# EAGLE design mjpanel_v2 (EAGLE 6.5.0)
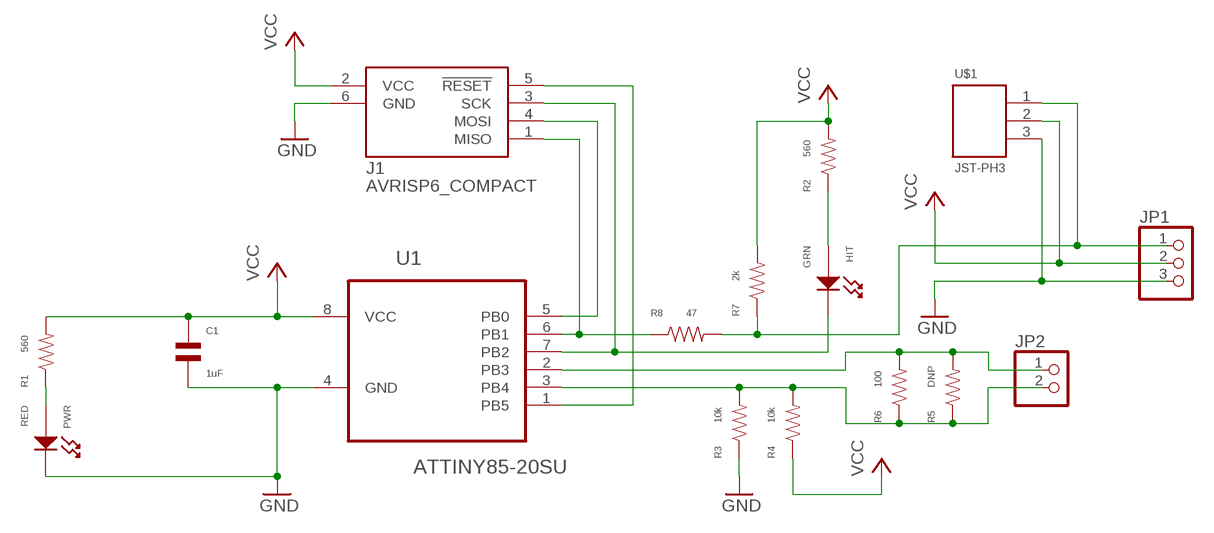
[diagram p0: schematic, sheet 1]

## Parts
C1  1uF  CAPACITOR_NP_0603  [C0603]
HIT  GRN  LED_SINGLE_0603  [LED0603]
J1  AVRISP6_COMPACT  [CON6P2R]
JP1  PINHD-1X3  [1X03]
JP2  PINHD-1X2  [1X02]
PWR  RED  LED_SINGLE_0603  [LED0603]
R1  560  RESISTOR_0603  [R0603]
R2  560  RESISTOR_0603  [R0603]
R3  10k  RESISTOR_0603  [R0603]
R4  10k  RESISTOR_0603  [R0603]
R5  DNP  RESISTOR_0603  [R0603]
R6  100  RESISTOR_0603  [R0603]
R7  2k  RESISTOR_0603  [R0603]
R8  47  RESISTOR_0603  [R0603]
U1  ATTINY85-20SU  [SOIC127P798X216-8N]
U$1  JST-PH3  [JST-PH3]

## Nets
GND: C1.P$2 J1.6(GND) JP1.3 PWR.CATHODE R3.P$1 U1.4(GND) U$1.3
N$1: PWR.ANODE R1.P$1
N$2: J1.5(!RESET) U1.1(PB5)
N$3: JP2.2 R3.P$2 R4.P$2 R5.P$1 R6.P$1 U1.3(PB4)
N$4: HIT.CATHODE J1.3(SCK) U1.7(PB2)
N$5: HIT.ANODE R2.P$1
N$6: JP2.1 R5.P$2 R6.P$2 U1.2(PB3)
N$7: J1.4(MOSI) U1.5(PB0)
N$8: JP1.1 R7.P$1 R8.P$2 U$1.1
N$9: J1.1(MISO) R8.P$1 U1.6(PB1)
VCC: C1.P$1 J1.2(VCC) JP1.2 R1.P$2 R2.P$2 R4.P$1 R7.P$2 U1.8(VCC) U$1.2

## Library data of the parts
C1 = MF_Passives:CAPACITOR_NP: Library: MF_Passives Description: Device for Non-Polarized Capacitors. Manufacture part number (MFG#), Voltage, Temperature Coefficient, and Tolerance can be added via Attributes.; DPN: 490-3897-1-ND; MFG#: N/A; PRICE10: 0.0440; TEMP_COF: N/A; TOLERANCE: N/A; VOLTAGE: N/A
HIT = MF_LEDs:LED_SINGLE: Library: MF_LEDs Description: Device for Single LED Packages. Manufacture part number (MFG#) can be added via Attributes.; DPN: 160-1446-1-ND; MFG#: N/A; PRICE10: 0.238
J1 = target:AVRISP6: 6-pin dual-row connector for Atmel AVRISP programmer interface; DPN: OR1108-ND; PRICE10: 0.399
JP1 = pinhead:PINHD-1X3: PIN HEADER; DPN: 952-2245-ND; PRICE10: 0.155
JP2 = pinhead:PINHD-1X2: PIN HEADER; DPN: 490-7800-ND; PRICE10: 0.794
PWR = MF_LEDs:LED_SINGLE: Library: MF_LEDs Description: Device for Single LED Packages. Manufacture part number (MFG#) can be added via Attributes.; DPN: 160-1436-1-ND; MFG#: N/A; PRICE10: 0.218
R1 R2 = MF_Passives:RESISTOR: Library: MF_Passives Description: Device for Resistors. Manufacture part number (MFG#), Voltage, Tolerance, and Wattage Rating can be added via Attributes.; DPN: P560GDKR-ND; MFG#: N/A; PRICE10: 0.00960; TOLERANCE: N/A; VOLTAGE: N/A; WATTAGE: N/A
R3 R4 = MF_Passives:RESISTOR: Library: MF_Passives Description: Device for Resistors. Manufacture part number (MFG#), Voltage, Tolerance, and Wattage Rating can be added via Attributes.; DPN: P10KGCT-ND; MFG#: N/A; PRICE10: 0.00960; TOLERANCE: N/A; VOLTAGE: N/A; WATTAGE: N/A
R5 = MF_Passives:RESISTOR: Library: MF_Passives Description: Device for Resistors. Manufacture part number (MFG#), Voltage, Tolerance, and Wattage Rating can be added via Attributes.; MFG#: N/A; TOLERANCE: N/A; VOLTAGE: N/A; WATTAGE: N/A
R6 = MF_Passives:RESISTOR: Library: MF_Passives Description: Device for Resistors. Manufacture part number (MFG#), Voltage, Tolerance, and Wattage Rating can be added via Attributes.; DPN: P100GCT-ND; MFG#: N/A; PRICE10: 0.00960; TOLERANCE: N/A; VOLTAGE: N/A; WATTAGE: N/A
R7 = MF_Passives:RESISTOR: Library: MF_Passives Description: Device for Resistors. Manufacture part number (MFG#), Voltage, Tolerance, and Wattage Rating can be added via Attributes.; DPN: 2.0KGCT-ND; MFG#: N/A; PRICE10: 0.00960; TOLERANCE: N/A; VOLTAGE: N/A; WATTAGE: N/A
R8 = MF_Passives:RESISTOR: Library: MF_Passives Description: Device for Resistors. Manufacture part number (MFG#), Voltage, Tolerance, and Wattage Rating can be added via Attributes.; DPN: P47GCT-ND; MFG#: N/A; PRICE10: 0.00960; TOLERANCE: N/A; VOLTAGE: N/A; WATTAGE: N/A
U1 = Atmel_By_element14_Batch_1-00:ATTINY85-20SU: 8-bit Microcontroller with In-System Programmable Flash; DPN: ATTINY85-20SU-ND; MPN: ATTINY85-20SU; OC_FARNELL: 1455164; OC_NEWARK: 58M3797; PACKAGE: SOIC-8; PRICE10: 1.386; SUPPLIER: Atmel
U$1 = jst-ph:JST-PH3; DPN: 455-1705-ND; PRICE10: 0.173

## Board
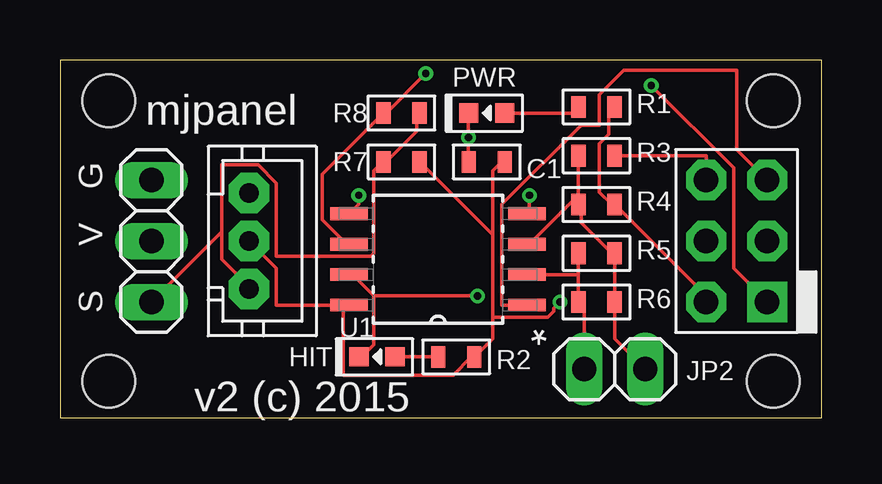
[diagram p1: board, top side]
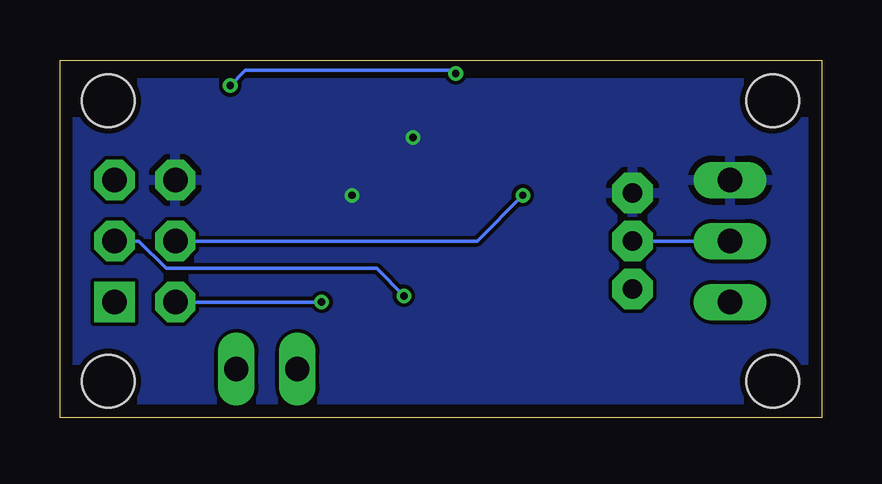
[diagram p2: board, bottom side, seen from below]

Size 31.73 x 14.91 mm. Coordinates in mm from the lower left corner, seen from the top.
Outline: 0,0 31.73,0 31.73,14.91 0,14.91 0,0
Copper layers (1*16): Top 0.035mm / dielectric 0.2mm / Bottom 0.035mm
Design rules "MF_2_Layer": minimum track width 6mil, minimum drill 12mil, track to track 6mil, track to pad 6mil, pad to pad 6mil, via to via 6mil, smd to smd 0mil, copper to edge 10mil, drill to drill 10mil, minimum pad ring 6mil, minimum via ring 6mil, stop-mask expansion 2mil, vias tented up to drill 25mil, thermal gap 10mil
Holes 2.2 mm at 2.03,13.21 2.03,1.52 29.72,1.52 29.72,13.21

### Footprints (pad centres in the part's own frame; a part is rotated, then mirrored left to right if it is on the bottom)
C0603 = smd 0.6 x 0.9: P$1 -0.75,0; P$2 0.75,0
LED0603 = smd 0.8 x 0.8: ANODE 0.75,0; CATHODE -0.75,0
CON6P2R = drill 1.016 pad 1.676 square: 1 -2.54,-1.27 | drill 1.016 pad 1.676 octagon: 2 -2.54,1.27; 3 0,-1.27; 4 0,1.27; 5 2.54,-1.27; 6 2.54,1.27
1X03 = drill 1.016 long: 1 -2.54,0; 2 0,0; 3 2.54,0
1X02 = drill 1.016 long: 1 -1.27,0; 2 1.27,0
R0603 = smd 0.6 x 0.9: P$1 -0.75,0; P$2 0.75,0
SOIC127P798X216-8N = smd 1.549 x 0.533: 1 -3.708,1.905; 2 -3.708,0.635; 3 -3.708,-0.635; 4 -3.708,-1.905; 5 3.708,-1.905; 6 3.708,-0.635; 7 3.708,0.635; 8 3.708,1.905
JST-PH3 = drill 0.813 pad 1.676 octagon: 1 2,0; 2 0,0; 3 -2,0

### Placement (x,y rotation side)
C1  17.78,10.67 180 top
HIT  13.21,2.54 0 top
J1  28.19,7.37 90 top
JP1  3.81,7.37 90 top
JP2  23.11,2.03 0 top
PWR  17.78,12.7 0 top
R1  22.35,12.95 0 top
R2  16.51,2.54 0 top
R3  22.35,10.92 180 top
R4  22.35,8.89 180 top
R5  22.35,6.86 180 top
R6  22.35,4.83 180 top
R7  14.22,10.67 0 top
R8  14.22,12.7 0 top
U1  15.75,6.6 180 top
U$1  7.87,7.37 270 top

### Tracks (layer width: path | path; a pad name or v marks a point on that pad's centre or on a via)
GND  (via drill 0.3)
  Top 0.152: PWR.CATHODE 17.02,12.7 v17.02,11.68 17.02,10.67 C1.P$2 | R3.P$1 26.92,10.92 J1.6 | v19.56,9.27 19.56,8.51 U1.4
  pour Bottom: 0.76,13.97 0.76,0.76 30.99,0.76 30.99,13.97
N$1
  Top 0.152: PWR.ANODE 21.59,12.7 R1.P$1
N$2
  Top 0.152: U1.1 18.41,4.7 18.41,8.89 21.72,12.19 22.48,12.19 22.48,13.46 23.5,14.48 28.19,14.48 28.19,11.18 J1.5
N$3
  Top 0.152: 23.11,4.83 23.11,6.86 R5.P$1 22.99,6.86 21.72,8.13 21.72,8.89 R4.P$2 | 21.59,9.27 R3.P$2 | 21.59,9.27 R4.P$2 | 21.59,9.27 19.56,7.24 U1.3 | 21.59,9.27 R4.P$2 | JP2.2 23.11,3.3 23.11,4.83 | 23.11,4.83 R6.P$1
N$4  (via drill 0.3)
  Top 0.152: 13.08,5.08 13.08,3.05 12.57,2.54 HIT.CATHODE | 13.08,5.08 12.19,5.97 U1.7 | v17.4,5.08 13.08,5.08
  Bottom 0.152: v17.4,5.08 18.54,6.22 27.3,6.22 28.45,7.37 J1.3
N$5
  Top 0.152: R2.P$1 HIT.ANODE
N$6
  Top 0.152: 21.59,5.97 R5.P$2 | 21.59,5.97 R6.P$2 21.72,4.83 21.84,4.7 JP2.1 | 21.59,5.97 U1.2
N$7  (via drill 0.3)
  Top 0.152: v12.45,9.27 12.45,8.89 12.06,8.51 U1.5
  Bottom 0.152: v12.45,9.27 14.35,7.37 J1.4
N$8
  Top 0.152: R8.P$2 14.86,12.7 14.86,11.94 13.59,10.67 R7.P$1 13.08,10.29 13.08,6.86 12.95,6.73 9.02,6.73 9.02,9.78 8.26,10.54 6.73,10.54 6.73,7.75 | 6.73,7.75 6.73,6.6 7.87,5.46 U$1.1 | 6.73,7.75 JP1.1
N$9  (via drill 0.3)
  Top 0.152: U1.6 11.94,7.24 10.92,8.26 10.92,10.16 R8.P$1 13.59,12.7 v15.24,14.35 | J1.1 28.07,6.22 28.07,10.41 v24.64,13.84
  Bottom 0.152: v24.64,13.84 24,14.48 15.37,14.48 v15.24,14.35
VCC  (via drill 0.3)
  Top 0.152: J1.2 26.92,5.08 23.11,8.89 R4.P$1 22.99,8.89 22.48,9.4 22.48,11.43 22.86,11.81 22.86,12.83 22.99,12.95 R1.P$2 | 18.03,7.62 18.03,10.29 18.41,10.67 C1.P$1 | 18.03,7.62 18.03,4.19 | 18.03,4.19 18.03,3.3 17.27,2.54 R2.P$2 17.14,2.54 16.38,1.78 11.81,1.78 11.81,4.7 | 18.03,7.62 14.99,10.67 R7.P$2 | 11.81,4.7 9.02,4.7 9.02,6.22 U$1.2 | 11.81,4.7 U1.8 11.94,4.7 | v20.83,4.83 20.57,4.57 20.57,4.45 20.32,4.19 18.03,4.19
  Bottom 0.152: U$1.2 JP1.2 | v20.83,4.83 J1.2

### Text on the board
tPlace: mjpanel | G | V | S | v2 (c) 2015